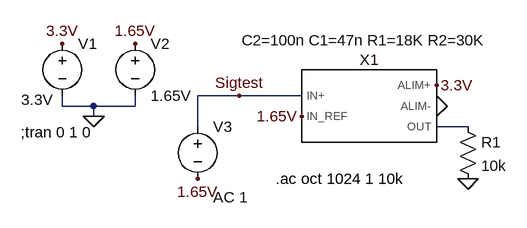
[diagram p0: schematic VCVS-LowPass-ButterworthNoGain-part-TEST.asc]
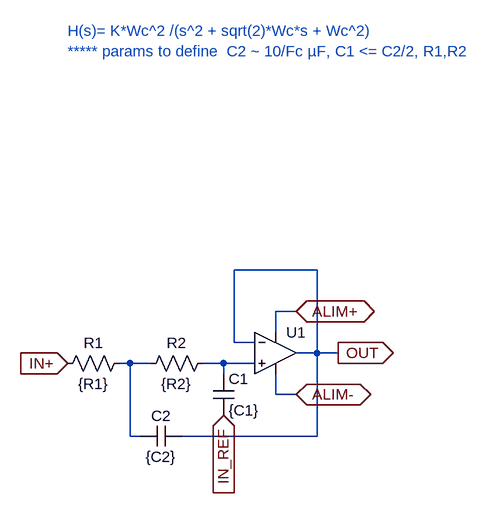
[diagram p1: sub-circuit vcvs-lowpass-butterworthnogain-part-sub.asc]
VCVS-LowPass-ButterworthNoGain-part-TEST.asc, the LTspice schematic file:
Version 4
SHEET 1 1212 680
WIRE 160 176 96 176
WIRE 256 176 160 176
WIRE -112 192 -112 176
WIRE -64 192 -112 192
WIRE 0 192 0 176
WIRE 0 192 -64 192
WIRE -64 208 -64 192
WIRE 96 224 96 176
WIRE 512 224 464 224
FLAG -64 208 0
FLAG 0 96 1.65V
FLAG -112 96 3.3V
FLAG 256 208 1.65V
FLAG 464 160 3.3V
FLAG 464 192 0
FLAG 512 304 0
FLAG 96 304 1.65V
FLAG 160 176 Sigtest
SYMBOL voltage -112 80 R0
WINDOW 3 -63 102 Left 2
WINDOW 123 0 0 Left 2
WINDOW 39 0 0 Left 2
SYMATTR Value 3.3V
SYMATTR InstName V1
SYMBOL voltage 0 80 R0
WINDOW 123 0 0 Left 2
WINDOW 39 0 0 Left 2
SYMATTR InstName V2
SYMATTR Value 1.65V
SYMBOL res 496 208 R0
SYMATTR InstName R1
SYMATTR Value 10k
SYMBOL voltage 96 208 R0
WINDOW 123 24 124 Left 2
WINDOW 39 0 0 Left 2
SYMATTR Value2 AC 1
SYMATTR InstName V3
SYMATTR Value ""
SYMBOL VCVS-LowPass-ButterworthNoGain-part-SUB 352 192 R0
WINDOW 39 2 -86 Bottom 2
SYMATTR InstName X1
SYMATTR SpiceLine C2=100n C1=47n R1=18K R2=30K
TEXT -176 232 Left 2 !;tran 0 1 0
TEXT 216 304 Left 2 !.ac oct 1024 1 10k

vcvs-lowpass-butterworthnogain-part-sub.asc, the sub-circuit schematic file:
Version 4
SHEET 1 968 680
WIRE 288 48 160 48
WIRE 256 112 224 112
WIRE 224 144 224 112
WIRE 160 160 160 48
WIRE 192 160 160 160
WIRE 288 176 288 48
WIRE 288 176 256 176
WIRE 320 176 288 176
WIRE 0 192 -16 192
WIRE 32 192 0 192
WIRE 144 192 112 192
WIRE 192 192 144 192
WIRE 144 208 144 192
WIRE 224 240 224 208
WIRE 256 240 224 240
WIRE 0 304 0 192
WIRE 16 304 0 304
WIRE 288 304 288 176
WIRE 288 304 80 304
FLAG 256 112 ALIM+
IOPIN 256 112 BiDir
FLAG 256 240 ALIM-
IOPIN 256 240 BiDir
FLAG 320 176 OUT
IOPIN 320 176 Out
FLAG 144 272 IN_REF
IOPIN 144 272 In
FLAG -96 192 IN+
IOPIN -96 192 In
SYMBOL Opamps\\UniversalOpamp2 224 176 R0
SYMATTR InstName U1
SYMBOL res 0 176 R90
WINDOW 0 0 56 VBottom 2
WINDOW 3 32 56 VTop 2
SYMATTR InstName R1
SYMATTR Value {R1}
SYMBOL res 128 176 R90
WINDOW 0 0 56 VBottom 2
WINDOW 3 32 56 VTop 2
SYMATTR InstName R2
SYMATTR Value {R2}
SYMBOL cap 128 208 R0
SYMATTR InstName C1
SYMATTR Value {C1}
SYMBOL cap 80 288 R90
WINDOW 0 0 32 VBottom 2
WINDOW 3 32 32 VTop 2
SYMATTR InstName C2
SYMATTR Value {C2}
TEXT -96 -320 Left 2 ;H(s)= K*Wc^2 /(s^2 + sqrt(2)*Wc*s + Wc^2)\n***** params to define  C2 ~ 10/Fc µF, C1 <= C2/2, R1,R2

The netlist it stands for:
* VCVS-LowPass-ButterworthNoGain-part-TEST.asc
V1 3.3V 0 3.3V
V2 1.65V 0 1.65V
R1 N001 0 10k
V3 Sigtest 1.65V AC 1
XX1 Sigtest 1.65V 3.3V 0 N001 vcvs-lowpass-butterworthnogain-part-sub params: C2=100n C1=47n R1=18K R2=30K

* block symbol definitions
.subckt vcvs-lowpass-butterworthnogain-part-sub IN+ IN_REF ALIM+ ALIM- OUT
XU1 N002 OUT ALIM+ ALIM- OUT level.2 Avol=1Meg GBW=10Meg Slew=10Meg ilimit=25m rail=0 Vos=0 phimargin=45 en=0 enk=0 in=0 ink=0 Rin=500Meg  ; pins IN+ IN- V+ V- OUT
R1 N001 IN+ {R1}
R2 N002 N001 {R2}
C1 N002 IN_REF {C1}
C2 OUT N001 {C2}
* H(s)= K*Wc^2 /(s^2 + sqrt(2)*Wc*s + Wc^2)
* ***** params to define  C2 ~ 10/Fc µF, C1 <= C2/2, R1,R2
.ends vcvs-lowpass-butterworthnogain-part-sub

;tran 0 1 0
.ac oct 1024 1 10k
.lib UniversalOpamps2.sub
.backanno
.end